# Altium schematic sheet CPLD.SchDoc
size A4; Author: Thomas Kreppel; CompanyName: Universidad de Santiago de Chile; Address1: Avenida Ecuador Nº 3519; Address2: Estación Central, Santiago; Address3: Chile; DocumentNumber: 7; SheetNumber: 7; SheetTotal: 10
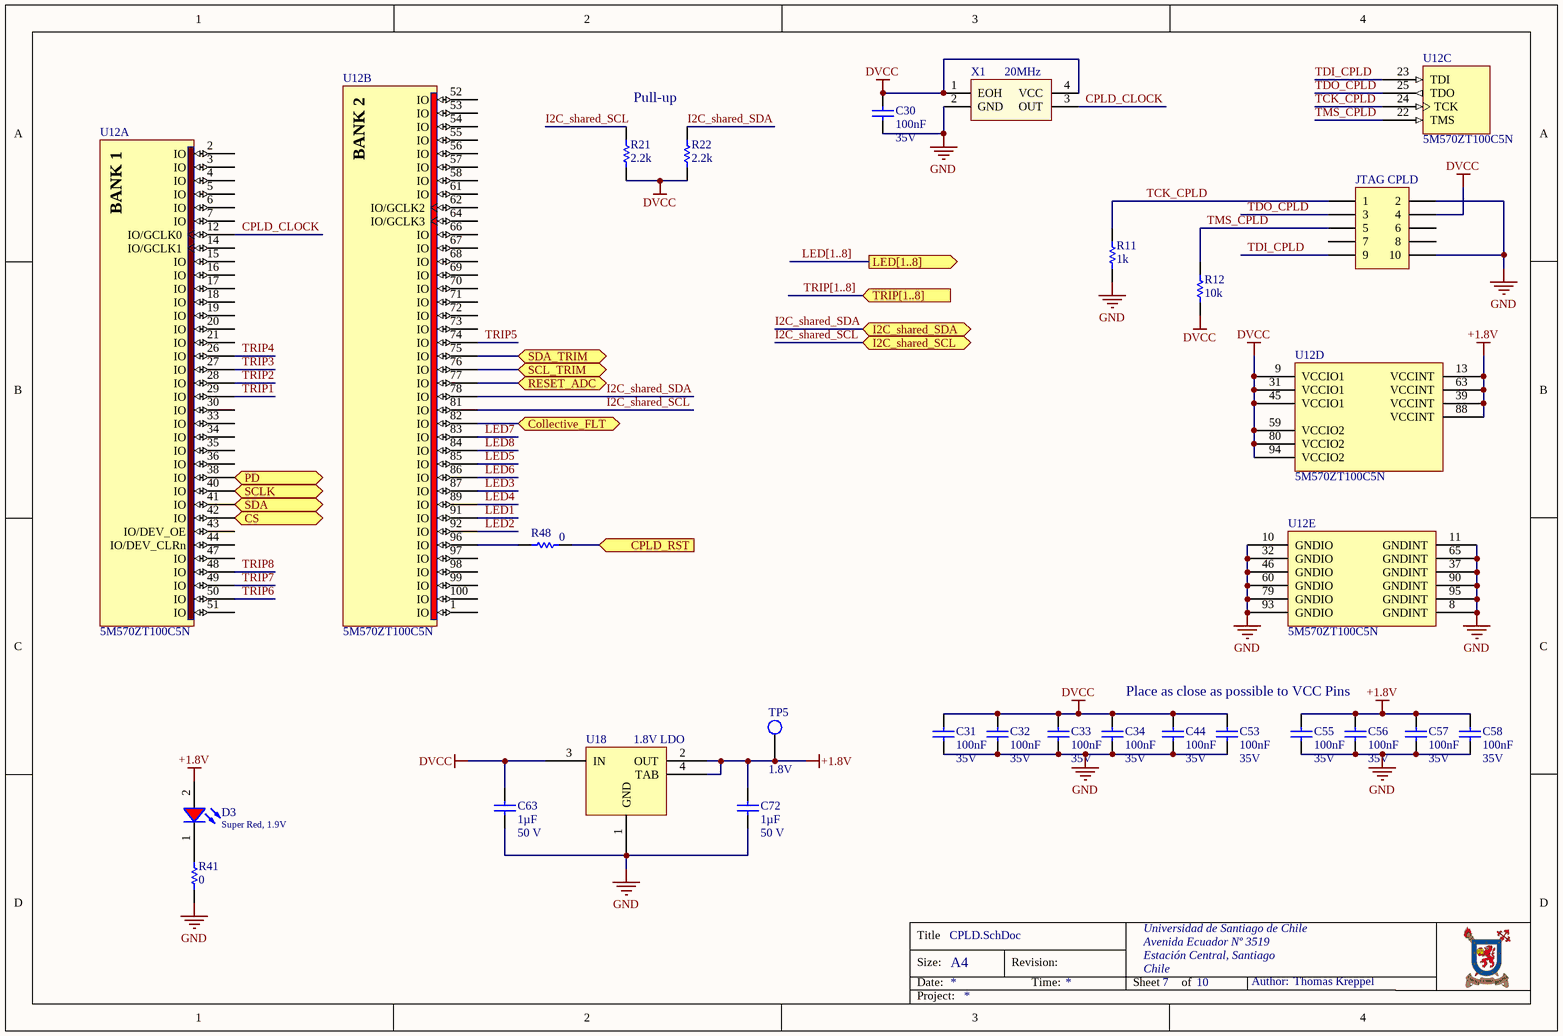
[diagram p0: CPLD.SchDoc]

## Parts
C30  100nF  Voltage: 35V  [CAP_0603]
C31  100nF  Voltage: 35V  [CAP_0603]
C32  100nF  Voltage: 35V  [CAP_0603]
C33  100nF  Voltage: 35V  [CAP_0603]
C34  100nF  Voltage: 35V  [CAP_0603]
C44  100nF  Voltage: 35V  [CAP_0603]
C53  100nF  Voltage: 35V  [CAP_0603]
C55  100nF  Voltage: 35V  [CAP_0603]
C56  100nF  Voltage: 35V  [CAP_0603]
C57  100nF  Voltage: 35V  [CAP_0603]
C58  100nF  Voltage: 35V  [CAP_0603]
C63  1µF  Voltage: 50 V  [CAP_0603]
C72  1µF  Voltage: 50 V  [CAP_0603]
D3  Super Red, 1.9V  [WL-SMCW_0603_H=0.7mm]
JTAG_CPLD  (no value)  [HEADER_JTAG - MAXII Horizontal]
R11  1k  [RES_0603]
R12  10k  [RES_0603]
R21  2.2k  [RES_0603]
R22  2.2k  [RES_0603]
R41  0  [RES_0603]
R48  0  [RES_0603]
TP5  1.8V  [TP_1.6mm]  (no BOM)
U12  5M570ZT100C5N  [TQFP100_N]  (parts A,B,C,D,E of 5)
U18  1.8V LDO  [SOT230P700X170-4N]
X1  20MHz  [CRYSTALOSC]

## Ports
Collective_FLT (bidir), CPLD_RST (in), CS (bidir), I2C_shared_SCL (bidir), I2C_shared_SDA (bidir), LED[1..8] (out), PD (bidir), RESET_ADC (bidir), SCL_TRIM (bidir), SCLK (bidir), SDA (bidir), SDA_TRIM (bidir), TRIP[1..8] (in)

## Nets
+1.8V: C55.1 C56.1 C57.1 C58.1 C72.1 D3.2(A) TP5.1 U12.13(VCCINT) U12.39(VCCINT) U12.63(VCCINT) U12.88(VCCINT) U18.2(OUT) U18.4(TAB)
DVCC: C30.1 C31.1 C32.1 C33.1 C34.1 C44.1 C53.1 C63.1 JTAG_CPLD.4 R12.1 R21.1 R22.1 U12.9(VCCIO1) U12.31(VCCIO1) U12.45(VCCIO1) U12.59(VCCIO2) U12.80(VCCIO2) U12.94(VCCIO2) U18.3(IN) X1.1(EOH) X1.4(VCC)
GND: C30.2 C31.2 C32.2 C33.2 C34.2 C44.2 C53.2 C55.2 C56.2 C57.2 C58.2 C63.2 C72.2 JTAG_CPLD.2 JTAG_CPLD.10 R11.1 R41.1 U12.8(GNDINT) U12.10(GNDIO) U12.11(GNDINT) U12.32(GNDIO) U12.37(GNDINT) U12.46(GNDIO) U12.60(GNDIO) U12.65(GNDINT) U12.79(GNDIO) U12.90(GNDINT) U12.93(GNDIO) U12.95(GNDINT) U18.1(GND) X1.2(GND)
Collective_FLT: U12.82(IO) ; port Collective_FLT
CPLD_CLOCK: U12.12(IO/GCLK0) X1.3(OUT)
CPLD_RST: R48.1 ; port CPLD_RST
CS: U12.42(IO) ; port CS
I2C_shared_SCL: R21.2 U12.81(IO) ; port I2C_shared_SCL
I2C_shared_SDA: R22.2 U12.78(IO) ; port I2C_shared_SDA
LED1: U12.91(IO)
LED2: U12.92(IO)
LED3: U12.87(IO)
LED4: U12.89(IO)
LED5: U12.85(IO)
LED6: U12.86(IO)
LED7: U12.83(IO)
LED8: U12.84(IO)
PD: U12.38(IO) ; port PD
RESET_ADC: U12.77(IO) ; port RESET_ADC
SCL_TRIM: U12.76(IO) ; port SCL_TRIM
SCLK: U12.40(IO) ; port SCLK
SDA: U12.41(IO) ; port SDA
SDA_TRIM: U12.75(IO) ; port SDA_TRIM
TCK_CPLD: JTAG_CPLD.1 R11.2 U12.24(TCK)
TDI_CPLD: JTAG_CPLD.9 U12.23(TDI)
TDO_CPLD: JTAG_CPLD.3 U12.25(TDO)
TMS_CPLD: JTAG_CPLD.5 R12.2 U12.22(TMS)
TRIP1: U12.29(IO)
TRIP2: U12.28(IO)
TRIP3: U12.27(IO)
TRIP4: U12.26(IO)
TRIP5: U12.74(IO)
TRIP6: U12.50(IO)
TRIP7: U12.49(IO)
TRIP8: U12.48(IO)
NetD3_1: D3.1(K) R41.2
NetR48_2: R48.2 U12.96(IO)

Not connected (* = marked no-connect by the designer): JTAG_CPLD 6 7 8; U12 1(IO) 2(IO) 3(IO) 4(IO) 5(IO) 6(IO) 7(IO) 14(IO/GCLK1) 15(IO) 16(IO) 17(IO) 18(IO) 19(IO) 20(IO) 21(IO) 30(IO) 33(IO) 34(IO) 35(IO) 36(IO) 43(IO/DEV_OE) 44(IO/DEV_CLRn) 47(IO) 51(IO) 52(IO) 53(IO) 54(IO) 55(IO) 56(IO) 57(IO) 58(IO) 61(IO) 62(IO/GCLK2) 64(IO/GCLK3) 66(IO) 67(IO) 68(IO) 69(IO) 70(IO) 71(IO) 72(IO) 73(IO) 97(IO) 98(IO) 99(IO) 100(IO)

## Buses and harness runs
bus LED[1..8] = port LED[1..8]
bus TRIP[1..8] = port TRIP[1..8]

## Notes on the sheet
- Pull-up
- Place as close as possible to VCC Pins
- Title
- Size:
- Date:
- A4
- Revision:
- Time:
- Sheet
- of
- Author:
- Project:
- (in symbol 5M570ZT100C5N, part A) BANK 1
- (in symbol 5M570ZT100C5N, part B) BANK 2

## Library data of the parts
C30-C34 C44 C53 C55-C58 = Cap_0603: Capacitor; MPN: C0603C104M5RACTU; Rule: PcbType=ProtelPcb; MF: KEMET; Dielectricum: X7R; Tolerance: 10%; Published: 8-Jun-2000; LatestRevisionDate: 17-Jul-2002; LatestRevisionNote: Re-released for DXP Platform.; PackageReference: RAD-0.3; Publisher: Altium Limited; Value: 100nF; Supplier 1: Digikey; Supplier 2: Mouser; Supplier Part Number 1: 399-7845-1-ND; Package: 0603
C63 C72 = Cap_0603: Capacitor Ceramic; MPN: C0603C105K3RACTU; MF: KEMET; Dielectricum: X7R; Tolerance: 10%; Value: 1µF; Supplier 1: Digikey; Supplier Part Number 1: 399-7376-1-ND; Package: 0603
D3 = 150060SS75000: WL-SMCW SMT Mono-color Chip LED Waterclear, size 0603, Super Red, 1.9V, 140deg; Chip Technology: AlInGaP; Dominant Wavelength typ.: 630nm; Luminous Intensity typ.: 60mcd; Peak Wavelength typ.: 645nm; MF: Wurth Elektronik; Viewing Angle: 140deg; ComponentLink1Description: Manufacturer; ComponentLink1URL: http://www.we-online.de; ComponentLink2URL: https://www.we-online.com/catalog/datasheet/150060SS75000.pdf; ComponentLink2Description: Datasheet; Forward Voltage typ.: 1.9V; Emitting Color: Super Red; Mounting Technology: SMT; Operating Temperature: -40 to +85degC; Published Date: December 2019; MPN: 150060SS75000; Packaging: Tape and Reel; Package: 0603; Supplier 1: Digikey; Supplier Part Number 1: 732-4979-1-ND
JTAG_CPLD = Header JTAG_MAXII: Header, 5-Pin, Dual row, Vertical; Manufacturer Part-Number: 61201021721; LatestRevisionDate: 17-Jul-2002; LatestRevisionNote: Re-released for DXP Platform.; Publisher: Altium Limited; Supplier 1: Digikey; Supplier 2: Mouser; Supplier Part Number 1: 732-2098-ND
R11 = Res0603: MPN: RC0603FR-071KL; Tolerance: 1%; Published: 8-Jun-2000; LatestRevisionDate: 17-Jul-2002; LatestRevisionNote: Re-released for DXP Platform.; PackageReference: AXIAL-0.3; Publisher: Altium Limited; PackageDescription: Axial Device, Thru-Hole; 2 Leads; 0.3 in Pin Spacing; Value: 1k; Supplier 1: Digikey; Supplier 2: Mouser; Supplier Part Number 1: 311-1.00KHRCT-ND; Package: 0603
R12 = Res0603: Manufacturer Part-Number: RT0603DRD0710KL; Tolerance: 1%; Published: 8-Jun-2000; LatestRevisionDate: 17-Jul-2002; LatestRevisionNote: Re-released for DXP Platform.; PackageReference: AXIAL-0.3; Publisher: Altium Limited; PackageDescription: Axial Device, Thru-Hole; 2 Leads; 0.3 in Pin Spacing; Value: 10k; Supplier 1: Digikey; Supplier 2: Mouser; Supplier Part Number 1: 311-10KDCT-ND; Package: 0603
R21 R22 = Res0603: MPN: RC0603FR-072K2L; Tolerance: 1%; Published: 8-Jun-2000; LatestRevisionDate: 17-Jul-2002; LatestRevisionNote: Re-released for DXP Platform.; PackageReference: AXIAL-0.3; Publisher: Altium Limited; PackageDescription: Axial Device, Thru-Hole; 2 Leads; 0.3 in Pin Spacing; Value: 2.2k; Supplier 1: Digikey; Supplier 2: Mouser; Supplier Part Number 1: 311-2.20KHRCT-ND; Package: 0603
R41 R48 = Res0603: Manufacturer Part-Number: CRCW06030000Z0EA; Tolerance: 1%; Published: 8-Jun-2000; LatestRevisionDate: 17-Jul-2002; LatestRevisionNote: Re-released for DXP Platform.; PackageReference: AXIAL-0.3; Publisher: Altium Limited; PackageDescription: Axial Device, Thru-Hole; 2 Leads; 0.3 in Pin Spacing; Value: 0; Supplier 1: Digikey; Supplier 2: Mouser; Supplier Part Number 1: 541-0.0GCT-ND; Package: 0603
TP5 = TP: 1.6mm Test Point Keystone; Manufacturer: Keystone Electronics; MPN: 5006; Created: 2020_04_Kreppel; Supplier 1: Digikey; Supplier Part Number 1: 36-5006-ND; Supplier 2: Mouser; MF: Keystone
U12 = 5M570ZT100C5N: MAX V CPLD 440MC 9NS 100TQFP; Manufacturer Part-Number: 5M570ZT100C5N; Supplier 1: Digikey; Supplier 2: Mouser; Supplier Part Number 1: 544-2839-ND
U18 = TLV1117LV18DCYR: 1A Positive 1.8V Fixed-Voltage Low-Dropout Regulator; Manufacturer: Texas Instruments; Voltage Input Max: 5.5 V; Created: 2020_04_Kreppel; Supplier 1: Digikey; Supplier Part Number 1: 296-28777-1-ND; Voltage Output: 1.8 V; Current Max: 1 A; Supplier 2: Mouser; Supplier Part Number 2: 595-TLV1117LV18DCYT
X1 = Oscilador_1: Oscilador 20MHz; Manufacturer Part-Number: CB3LV-3C-20M000000; Manufacturer 1: CTS-Frequency Controls; Value: 20MHz; Supplier 1: Digikey; Supplier 2: Mouser; Supplier Part Number 1: 110-CB3LV-3C-20M000000CT-ND